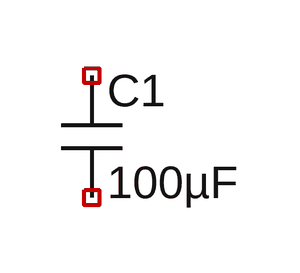
[diagram p0: schematic c100uF.asc]
c100uF.asc, the LTspice schematic file:
Version 4
SHEET 1 880 680
SYMBOL cap 112 128 R0
SYMATTR InstName C1
SYMATTR Value 100µF

The netlist it stands for:
* c100uF.asc
C1 NC_01 NC_02 100µF
.backanno
.end